# EAGLE design CPU_Dev_revA.1 (EAGLE 9.1.0)
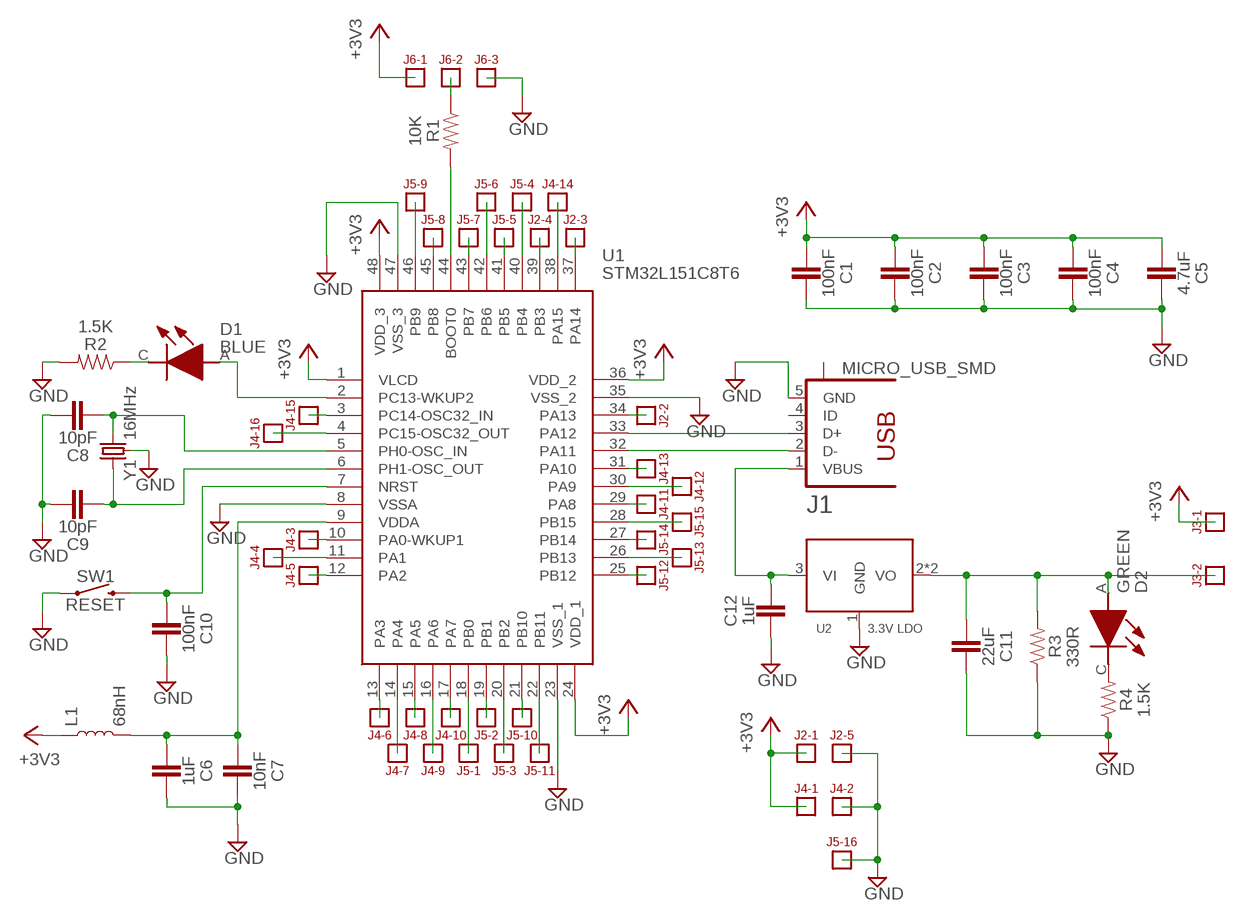
[diagram p0: schematic, sheet 1]

## Parts
C1  100nF  C_0402  [0402]
C2  100nF  C_0402  [0402]
C3  100nF  C_0402  [0402]
C4  100nF  C_0402  [0402]
C5  4.7uF  C_0402  [0402]
C6  1uF  C_0402  [0402]
C7  10nF  C_0402  [0402]
C8  10pF  C_0402  [0402]
C9  10pF  C_0402  [0402]
C10  100nF  C_0402  [0402]
C11  22uF  C_1206  [1206]
C12  1uF  C_0402  [0402]
D1  BLUE  LED_0603  [LED_0603]
D2  GREEN  LED_0603  [LED_0603]
J1  MICRO_USB_SMD  [10118192-0002LF]
J2  HEADER_5PIN  [HEADER_5PIN]
J3  HEADER_2PIN  [HEADER_2PIN]
J4  HEADER_16PIN  [HEADER_16PIN]
J5  HEADER_16PIN  [HEADER_16PIN]
J6  HEADER_3PIN  [HEADER_3PIN]
L1  68nH  L_0603  [0603]
R1  10K  R_0402  [0402]
R2  1.5K  R_0402  [0402]
R3  330R  R_0402  [0402]
R4  1.5K  R_0402  [0402]
SW1  RESET  PUSHBUTTON_SMD  [PUSHBUTTON_SMD]
U1  STM32L151C8T6  [LQFP-48_7X7]
U2  3.3V LDO  VREG_SOT223  [SOT223]
Y1  16MHz  XTAL_SMD3225-4P  [SMD3225-4P]

## Nets
+3V3: C1.1 C2.1 C3.1 C4.1 C5.1 J2.P$1 J3.P$1 J4.P$1 J6.P$1 L1.1 U1.1(VLCD) U1.24(VDD_1) U1.36(VDD_2) U1.48(VDD_3)
BOOT0: R1.2 U1.44(BOOT0)
GND: C1.2 C2.2 C3.2 C4.2 C5.2 C6.2 C7.2 C8.2 C9.2 C10.2 C11.2 C12.1 J1.5(GND) J2.P$5 J4.P$2 J5.P$16 J6.P$3 R2.2 R3.1 R4.1 SW1.A1 SW1.B1 U1.8(VSSA) U1.23(VSS_1) U1.35(VSS_2) U1.47(VSS_3) U2.1(GND) Y1.2 Y1.4
N$1: C12.2 J1.1(VBUS) U2.3(VI)
N$2: C11.1 D2.A J3.P$2 R3.2 U2.2(VO) U2.4(VO)
N$4: D2.C(K) R4.2
N$8: D1.C(K) R2.1
N$9: J6.P$2 R1.1
NRST: C10.1 SW1.C1 SW1.D1 U1.7(NRST)
PA0: J4.P$3 U1.10(PA0-WKUP1)
PA1: J4.P$4 U1.11(PA1)
PA2: J4.P$5 U1.12(PA2)
PA3: J4.P$6 U1.13(PA3)
PA4: J4.P$7 U1.14(PA4)
PA5: J4.P$8 U1.15(PA5)
PA6: J4.P$9 U1.16(PA6)
PA7: J4.P$10 U1.17(PA7)
PA8: J4.P$11 U1.29(PA8)
PA9: J4.P$12 U1.30(PA9)
PA10: J4.P$13 U1.31(PA10)
PA11: J1.2(D-) U1.32(PA11)
PA12: J1.3(D+) U1.33(PA12)
PA13: J2.P$2 U1.34(PA13)
PA15: J4.P$14 U1.38(PA15)
PB0: J5.P$1 U1.18(PB0)
PB1: J5.P$2 U1.19(PB1)
PB2: J5.P$3 U1.20(PB2)
PB3: J2.P$4 U1.39(PB3)
PB4: J5.P$4 U1.40(PB4)
PB5: J5.P$5 U1.41(PB5)
PB6: J5.P$6 U1.42(PB6)
PB7: J5.P$7 U1.43(PB7)
PB8: J5.P$8 U1.45(PB8)
PB9: J5.P$9 U1.46(PB9)
PB10: J5.P$10 U1.21(PB10)
PB11: J5.P$11 U1.22(PB11)
PB12: J5.P$12 U1.25(PB12)
PB13: J5.P$13 U1.26(PB13)
PB14: J5.P$14 U1.27(PB14)
PB15: J5.P$15 U1.28(PB15)
PC14: J4.P$15 U1.3(PC14-OSC32_IN)
PC15: J4.P$16 U1.4(PC15-OSC32_OUT)
PH0: C8.1 U1.5(PH0-OSC_IN) Y1.3
PH1: C9.1 U1.6(PH1-OSC_OUT) Y1.1
SWCLK: J2.P$3 U1.37(PA14)
VDDA: C6.1 C7.1 L1.2 U1.9(VDDA)
WKUP: D1.A U1.2(PC13-WKUP2)
Unconnected: J1.4(ID) J1.S1

## Library data of the parts
C1-C10 C12 = NSE LABS:C_0402: Samsung Source: Datasheet <https://datasheet.lcsc.com/szlcsc/Samsung-Electro-Mechanics-CL05B104KB54PNC_C307331.pdf>
C11 = NSE LABS:C_1206
D1 D2 = NSE LABS:LED_0603
J1 = NSE LABS:MICRO_USB_SMD: Receptacle, micro-USB, type A/B Tyco Electronics
J2 = NSE LABS:HEADER_5PIN
J3 = NSE LABS:HEADER_2PIN
J4 J5 = NSE LABS:HEADER_16PIN
J6 = NSE LABS:HEADER_3PIN
L1 = NSE LABS:L_0603
R1-R4 = NSE LABS:R_0402
SW1 = NSE LABS:PUSHBUTTON_SMD
U1 = NSE LABS:STM32L151C8T6: MCU 32-bit ARM Cortex M3 RISC 64KB Flash 2.5V/3.3V 48-Pin LQFP Tray Source: Datasheet <https://www.st.com/resource/en/datasheet/stm32l151c8.pdf>; ARROW_PART_NUMBER: STM32L151C8T6; ARROW_PRICE-STOCK: https://www.arrow.com/en/products/stm32l151c8t6/stmicroelectronics?region=nac; DESCRIPTION: MCU 32-bit ARM Cortex M3 RISC 64KB Flash 2.5V/3.3V 48-Pin LQFP Tray; HEIGHT: 1.6mm; MANUFACTURER_NAME: STMicroelectronics; MANUFACTURER_PART_NUMBER: STM32L151C8T6; MOUSER_PART_NUMBER: 511-STM32L151C8T6; MOUSER_PRICE-STOCK: https://www.mouser.co.uk/ProductDetail/STMicroelectronics/STM32L151C8T6?qs=G0rgft3hAxIeaXnyBBjaCA%3D%3D
U2 = NSE LABS:VREG_SOT223
Y1 = NSE LABS:XTAL_SMD3225-4P

## Board
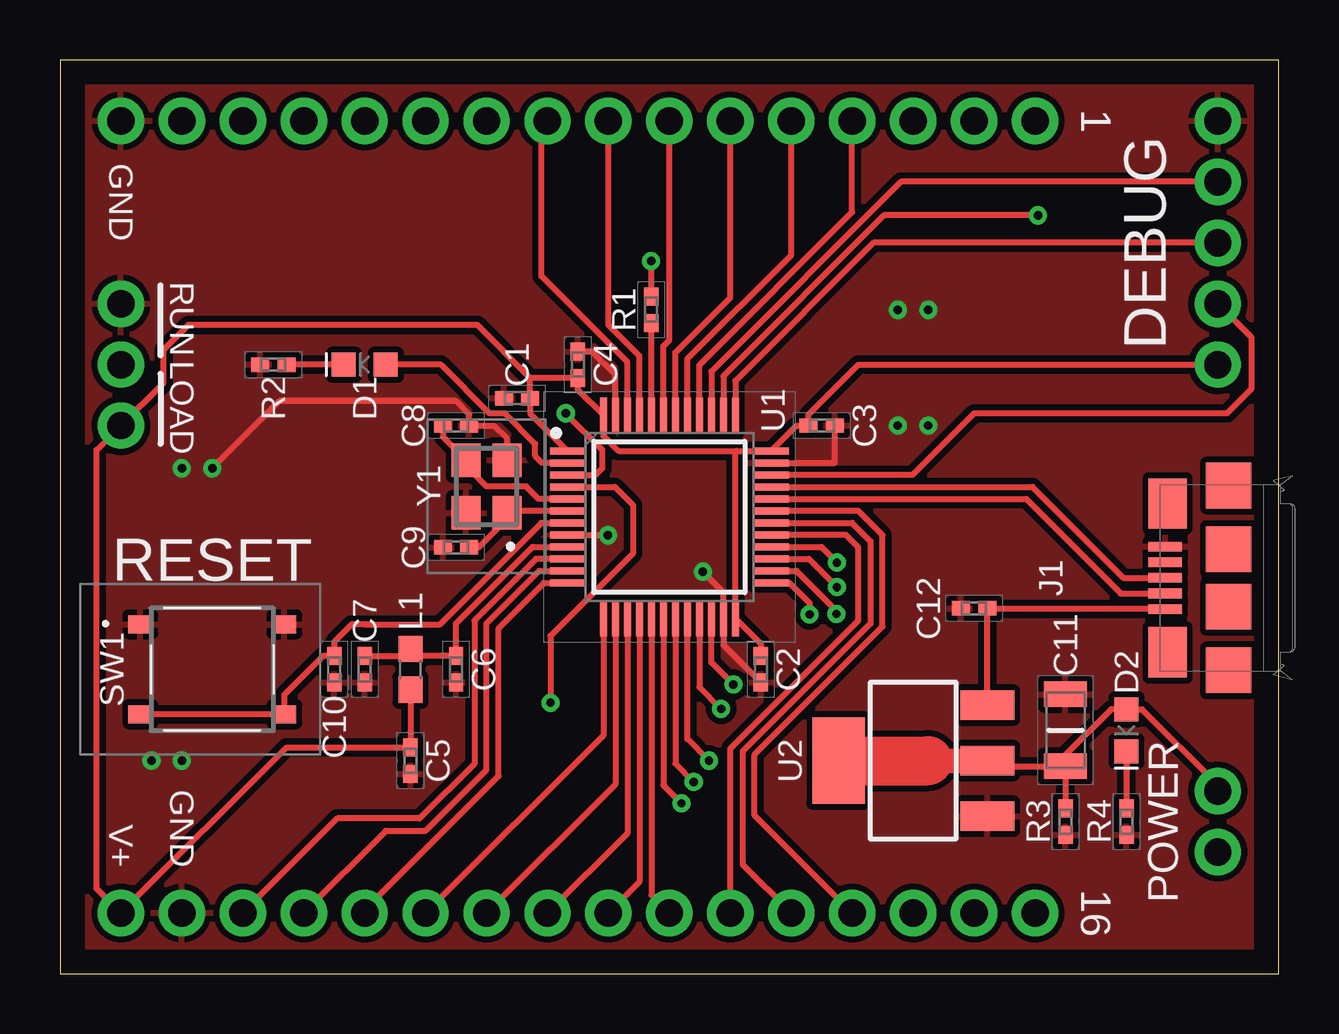
[diagram p1: board, top side]
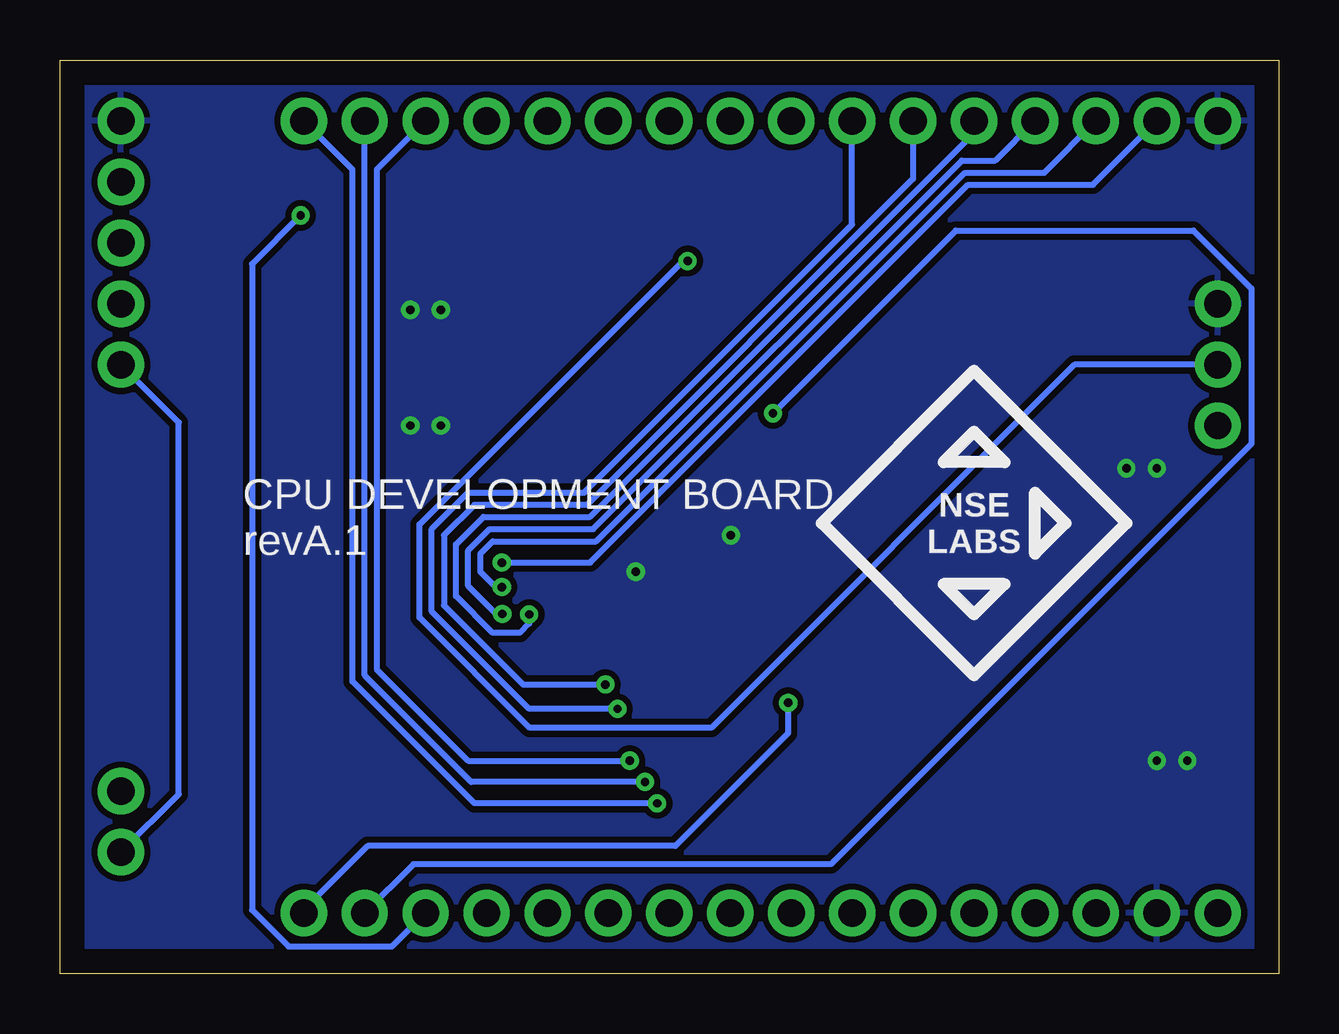
[diagram p2: board, bottom side, seen from below]

Size 50.8 x 38.1 mm. Coordinates in mm from the lower left corner, seen from the top.
Outline: 0,0 50.8,0 50.8,38.1 0,38.1 0,0
Copper layers (1*16): Top 0.035mm / dielectric 1.5mm / Bottom 0.035mm
Design rules "default": minimum track width 6mil, minimum drill 0.35mm, track to track 6mil, track to pad 6mil, pad to pad 6mil, via to via 6mil, smd to smd 6mil, copper to edge 40mil, drill to drill 6mil, minimum pad ring 10mil, minimum via ring 8mil, stop-mask expansion 4mil, vias tented up to drill 0mil, thermal gap 10mil

### Footprints (pad centres in the part's own frame; a part is rotated, then mirrored left to right if it is on the bottom)
0402 = smd 0.75 x 0.6: 1 -0.55,0; 2 0.55,0
1206 = smd 1.05 x 1.8: 1 -1.5,0; 2 1.5,0
LED_0603 = smd 1 x 1: A -0.877,0; C 0.877,0
10118192-0002LF = smd 0.4 x 1.4: 1 -1.3,1.2; 2 -0.65,1.2; 3 0,1.2; 4 0.65,1.2; 5 1.3,1.2 | smd 1.9 x 1.9: M1 -1.2,-1.45; M2 1.2,-1.45; S1 -3.85,-1.45; S2 3.85,-1.45 | smd 2.1 x 1.6: S3 -3.1,1.1; S4 3.1,1.1
HEADER_5PIN = drill 1.143 pad 1.93: P$1 -5.08,0; P$2 -2.54,0; P$3 0,0; P$4 2.54,0; P$5 5.08,0
HEADER_2PIN = drill 1.143 pad 1.93: P$1 -1.27,0; P$2 1.27,0
HEADER_16PIN = drill 1.143 pad 1.93: P$1 -19.05,0; P$2 -16.51,0; P$3 -13.97,0; P$4 -11.43,0; P$5 -8.89,0; P$6 -6.35,0; P$7 -3.81,0; P$8 -1.27,0; P$9 1.27,0; P$10 3.81,0; P$11 6.35,0; P$12 8.89,0; P$13 11.43,0; P$14 13.97,0; P$15 16.51,0; P$16 19.05,0
HEADER_3PIN = drill 1.143 pad 1.93: P$1 -2.54,0; P$2 0,0; P$3 2.54,0
0603 = smd 1.1 x 1: 1 -0.85,0; 2 0.85,0
PUSHBUTTON_SMD = smd 1 x 0.75: A1 -3,1.875; B1 3,1.875; C1 -3,-1.875; D1 3,-1.875
LQFP-48_7X7 = smd 1.475 x 0.3: 1 -4.238,2.75; 2 -4.238,2.25; 3 -4.238,1.75; 4 -4.238,1.25; 5 -4.238,0.75; 6 -4.238,0.25; 7 -4.238,-0.25; 8 -4.238,-0.75; 9 -4.238,-1.25; 10 -4.238,-1.75; 11 -4.238,-2.25; 12 -4.238,-2.75; 25 4.238,-2.75; 26 4.238,-2.25; 27 4.238,-1.75; 28 4.238,-1.25; 29 4.238,-0.75; 30 4.238,-0.25; 31 4.238,0.25; 32 4.238,0.75; 33 4.238,1.25; 34 4.238,1.75; 35 4.238,2.25; 36 4.238,2.75 | smd 0.3 x 1.475: 13 -2.75,-4.238; 14 -2.25,-4.238; 15 -1.75,-4.238; 16 -1.25,-4.238; 17 -0.75,-4.238; 18 -0.25,-4.238; 19 0.25,-4.238; 20 0.75,-4.238; 21 1.25,-4.238; 22 1.75,-4.238; 23 2.25,-4.238; 24 2.75,-4.238; 37 2.75,4.238; 38 2.25,4.238; 39 1.75,4.238; 40 1.25,4.238; 41 0.75,4.238; 42 0.25,4.238; 43 -0.25,4.238; 44 -0.75,4.238; 45 -1.25,4.238; 46 -1.75,4.238; 47 -2.25,4.238; 48 -2.75,4.238
SOT223 = smd 1.219 x 2.235: 1 -2.311,-3.099; 2 0,-3.099; 3 2.311,-3.099 | smd 3.6 x 2.2: 4 0,3.099
SMD3225-4P = smd 1.4 x 1.2: 1 -1.1,-0.85; 2 1.1,-0.85; 3 1.1,0.85; 4 -1.1,0.85

### Placement (x,y rotation side)
C1  19.05,24 180 top
C2  29.21,12.7 270 top
C3  31.75,22.86 0 top
C4  21.59,25.4 90 top
C5  14.61,8.89 270 top
C6  16.51,12.7 270 top
C7  12.7,12.7 270 top
C8  16.51,22.86 0 top
C9  16.51,17.78 180 top
C10  11.43,12.7 270 top
C11  41.91,10.16 90 top
C12  38.1,15.24 0 top
D1  12.7,25.4 180 top
D2  44.45,10.16 270 top
J1  47.27,16.51 90 top
J2  48.26,30.48 90 top
J3  48.26,6.35 90 top
J4  21.59,2.54 0 top
J5  21.59,35.56 180 top
J6  2.54,25.4 90 top
L1  14.61,12.7 90 top
R1  24.64,27.69 270 top
R2  8.89,25.4 180 top
R3  41.91,6.35 90 top
R4  44.45,6.35 90 top
SW1  6.35,12.7 0 top
U1  25.4,19.05 0 top
U2  35.56,8.89 90 top
Y1  17.78,20.32 90 top

### Tracks (layer width: path | path; a pad name or v marks a point on that pad's centre or on a via)
+3V3
  Top 0.254: U1.1 19.6,23.36 C1.1 19.6,24.85 | U1.24 29.21,13.75 C2.1 | L1.1 14.61,10.07 C5.1 9.44,9.44 J4.P$1 1.52,3.56 1.52,21.84 J6.P$1 4.32,24.64 4.32,26.04 5.33,27.05 17.4,27.05 19.6,24.85 | U1.24 | 28.19,21.8 U1.36 30.7,22.86 C3.1 31.2,23.33 33.27,25.4 J2.P$1 | U1.24 28.15,21.76 28.19,21.8 | 28.19,21.8 23.29,21.8 22.65,22.43 U1.48 21.59,24.35 C4.1 19.6,24.85
  Bottom 0.254: J2.P$1 45.85,22.99 45.85,7.49 J3.P$1
BOOT0
  Top 0.254: U1.44 24.65,27.12 R1.2
GND  (via drill 0.35)
  Top 0.254: U1.35 32.3,21.3 C3.2 | U1.8 v22.84,18.3 v22.84,18.29 | v26.8,16.76 27.65,15.91 U1.23 27.65,13.71 C2.2 | U1.47 23.15,24.98 22.18,25.95 C4.2 | Y1.2 18.63,22.31 18.08,22.86 C8.2 17.06,23.33 16.51,23.88 9.14,23.88 v6.35,21.08
  other vias: 36.2,22.86 34.92,22.86 3.81,8.89 5.08,8.89 5.08,21.08 36.2,27.69 34.92,27.69
  pour Top (isolate 0.254): 0,0 50.8,0 50.8,38.1 0,38.1
  pour Bottom (isolate 0.254): 0,0 50.8,0 50.8,38.1 0,38.1
N$1
  Top 0.254: U2.3 C12.2 | C12.2 | J1.1 38.68,15.21 C12.2
N$2
  Top 0.254: U2.2 38.89,8.66 C11.1 | C11.1 R3.2 | C11.1 41.91,9.13 43.81,11.04 D2.A 45.1,11.04 48.26,7.87 J3.P$2
  Top 1.016: 36.2,8.89 U2.2
  Top 2.032: U2.4 36.2,8.89
N$4
  Top 0.254: D2.C R4.2
N$8
  Top 0.254: D1.C R2.1
N$9  (via drill 0.35)
  Top 0.254: v24.64,29.72 R1.1
  Bottom 0.254: J6.P$2 8.51,25.4 23.64,10.26 31.22,10.26 35.81,14.86 35.81,18.74 24.83,29.72 v24.64,29.72
NRST
  Top 0.254: 12.7,14.57 12.83,14.57 | 12.83,14.57 15.85,14.57 20.07,18.8 U1.7 | 12.83,14.57 | 12.83,14.57 12.16,14.57 11.43,13.84 C10.1 10.96,13.25 9.35,11.64 SW1.D1 SW1.C1
PA0
  Top 0.254: U1.10 19.84,17.3 17.27,14.73 17.27,8.76 14.99,6.48 11.56,6.48 J4.P$3
PA1
  Top 0.254: J4.P$4 13.59,5.97 15.24,5.97 17.78,8.51 17.78,14.61 19.98,16.8 U1.11
PA2
  Top 0.254: U1.12 20.18,16.3 18.29,14.41 18.29,8.26 12.7,2.67 J4.P$5
PA3
  Top 0.254: U1.13 22.65,9.95 J4.P$6
PA4
  Top 0.254: U1.14 23.15,7.91 J4.P$7
PA5
  Top 0.254: U1.15 23.65,5.87 J4.P$8
PA6
  Top 0.254: U1.16 24.15,3.83 J4.P$9
PA7
  Top 0.254: U1.17 24.65,3.29 J4.P$10
PA8
  Top 0.254: J4.P$11 27.94,9.4 33.27,14.73 33.27,17.78 32.75,18.3 U1.29
PA9
  Top 0.254: U1.30 33.02,18.8 33.78,18.03 33.78,14.61 28.45,9.27 28.45,4.57 J4.P$12
PA10
  Top 0.254: J4.P$13 28.96,6.6 28.96,9.14 34.29,14.48 34.29,18.29 33.28,19.3 U1.31
PA11
  Top 0.254: U1.32 40.27,19.8 44.21,15.86 J1.2
PA12
  Top 0.254: U1.33 40.53,20.3 44.32,16.51 J1.3
PA13
  Top 0.254: J2.P$2 49.66,26.54 49.66,24.38 48.64,23.37 38.1,23.37 35.53,20.8 U1.34
PA15  (via drill 0.35)
  Top 0.254: U1.38 27.65,24.92 34.35,31.62 v40.77,31.62
  Bottom 0.254: v40.77,31.62 42.8,29.59 42.8,2.67 41.27,1.14 36.96,1.14 J4.P$14
PB0  (via drill 0.35)
  Top 0.254: U1.18 25.15,7.87 v25.91,7.11
  Bottom 0.254: v25.91,7.11 33.53,7.11 38.61,12.19 38.61,33.53 J5.P$1
PB1  (via drill 0.35)
  Top 0.254: U1.19 25.65,8.77 v26.42,8
  Bottom 0.254: J5.P$2 38.1,12.45 33.66,8 v26.42,8
PB2  (via drill 0.35)
  Top 0.254: v27.05,8.89 26.15,9.79 U1.20
  Bottom 0.254: v27.05,8.89 33.78,8.89 37.59,12.7 37.59,33.53 J5.P$3
PB3
  Top 0.254: J2.P$4 35.05,33.02 27.15,25.12 U1.39
PB4
  Top 0.254: J5.P$4 33.02,31.75 26.65,25.38 U1.40
PB5
  Top 0.254: U1.41 26.15,25.26 | 26.15,25.26 | 26.15,25.26 26.15,25.64 30.48,29.97 J5.P$5
PB6
  Top 0.254: U1.42 25.65,25.9 27.94,28.19 J5.P$6
PB7
  Top 0.254: J5.P$7 25.4,26.42 25.15,26.17 U1.43
PB8
  Top 0.254: U1.45 24.15,25.76 22.86,27.05 J5.P$8
PB9
  Top 0.254: U1.46 23.65,25.5 20.07,29.08 20.07,35.31 J5.P$9
PB10  (via drill 0.35)
  Top 0.254: U1.21 26.65,11.96 v27.56,11.05
  Bottom 0.254: v27.56,11.05 31.24,11.05 35.31,15.11 35.31,18.54 33.78,20.07 28.96,20.07 17.78,31.24 J5.P$10
PB11  (via drill 0.35)
  Top 0.254: U1.22 27.15,12.98 v28.07,12.06
  Bottom 0.254: J5.P$11 15.24,33.15 28.83,19.56 33.53,19.56 34.8,18.29 34.8,15.37 31.5,12.06 v28.07,12.06
PB12  (via drill 0.35)
  Top 0.254: U1.25 30.4,16.3 31.24,15.46 v31.24,14.99
  Bottom 0.254: v31.24,14.99 31.24,14.61 31.62,14.22 32.77,14.22 34.29,15.75 34.29,17.91 33.15,19.05 28.7,19.05 12.7,35.05 J5.P$12
PB13  (via drill 0.35)
  Top 0.254: U1.26 30.7,16.8 32.11,15.39 32.37,15.13 v32.37,15.01
  Bottom 0.254: v32.37,15.01 32.62,15.01 33.78,16.17 33.78,17.65 32.89,18.54 28.57,18.54 13.21,33.91 11.81,33.91 J5.P$13
PB14  (via drill 0.35)
  Top 0.254: U1.27 31.21,17.3 v32.38,16.13
  Bottom 0.254: v32.38,16.13 32.64,16.13 33.27,16.76 33.27,17.53 32.77,18.03 28.45,18.03 13.08,33.4 9.78,33.4 J5.P$14
PB15  (via drill 0.35)
  Top 0.254: U1.28 31.73,17.8 v32.38,17.14
  Bottom 0.254: v32.38,17.14 28.7,17.14 12.95,32.89 7.75,32.89 J5.P$15
PC14  (via drill 0.35)
  Top 0.254: U1.3 22.32,20.8 22.61,21.08 22.61,21.84 v21.08,23.37
  Bottom 0.254: J4.P$15 36.07,4.57 18.67,4.57 1.14,22.1 1.14,28.57 3.56,30.99 13.46,30.99 v21.08,23.37
PC15  (via drill 0.35)
  Top 0.254: U1.4 23.13,20.3 23.88,19.56 23.88,17.53 20.45,14.1 v20.45,11.3
  Bottom 0.254: J4.P$16 40.64,2.67 37.97,5.33 25.15,5.33 20.45,10.03 v20.45,11.3
PH0
  Top 0.254: C8.1 15.96,22.39 Y1.3 16.93,21.17 17.78,20.32 19.43,20.32 19.95,19.8 U1.5
PH1
  Top 0.254: C9.1 17.44,17.78 18.63,18.97 Y1.1 18.71,19.3 U1.6
SWCLK
  Top 0.254: J2.P$3 33.91,30.48 28.15,24.72 U1.37
VDDA
  Top 0.254: C7.1 14.3,13.25 L1.2 14.9,13.25 C6.1 16.51,14.61 19.7,17.8 U1.9
WKUP
  Top 0.254: U1.2 20.1,21.3 19.81,21.59 19.81,22.1 18.54,23.37 17.91,23.37 15.88,25.4 D1.A

### Text on the board
tPlace: 1 | GND | DEBUG | RUN | LOAD | RESET | POWER | V+ | GND | 16
bPlace: NSE / LABS | CPU DEVELOPMENT BOARD / revA.1